# EasyEDA Pro project tianmengxing-expansion-board.epro, schematic Schematic1

## Sheets
1 P1: Assembly Variant: Basic; Board Name: Board1; Create Date: 2026-07-14; Page Name: P1; Project Name: 天猛星; Schematic Name: Schematic1; Update Date: 2026-07-14; Company: 嘉立创EDA; Page Size: A4; Version: V1.0
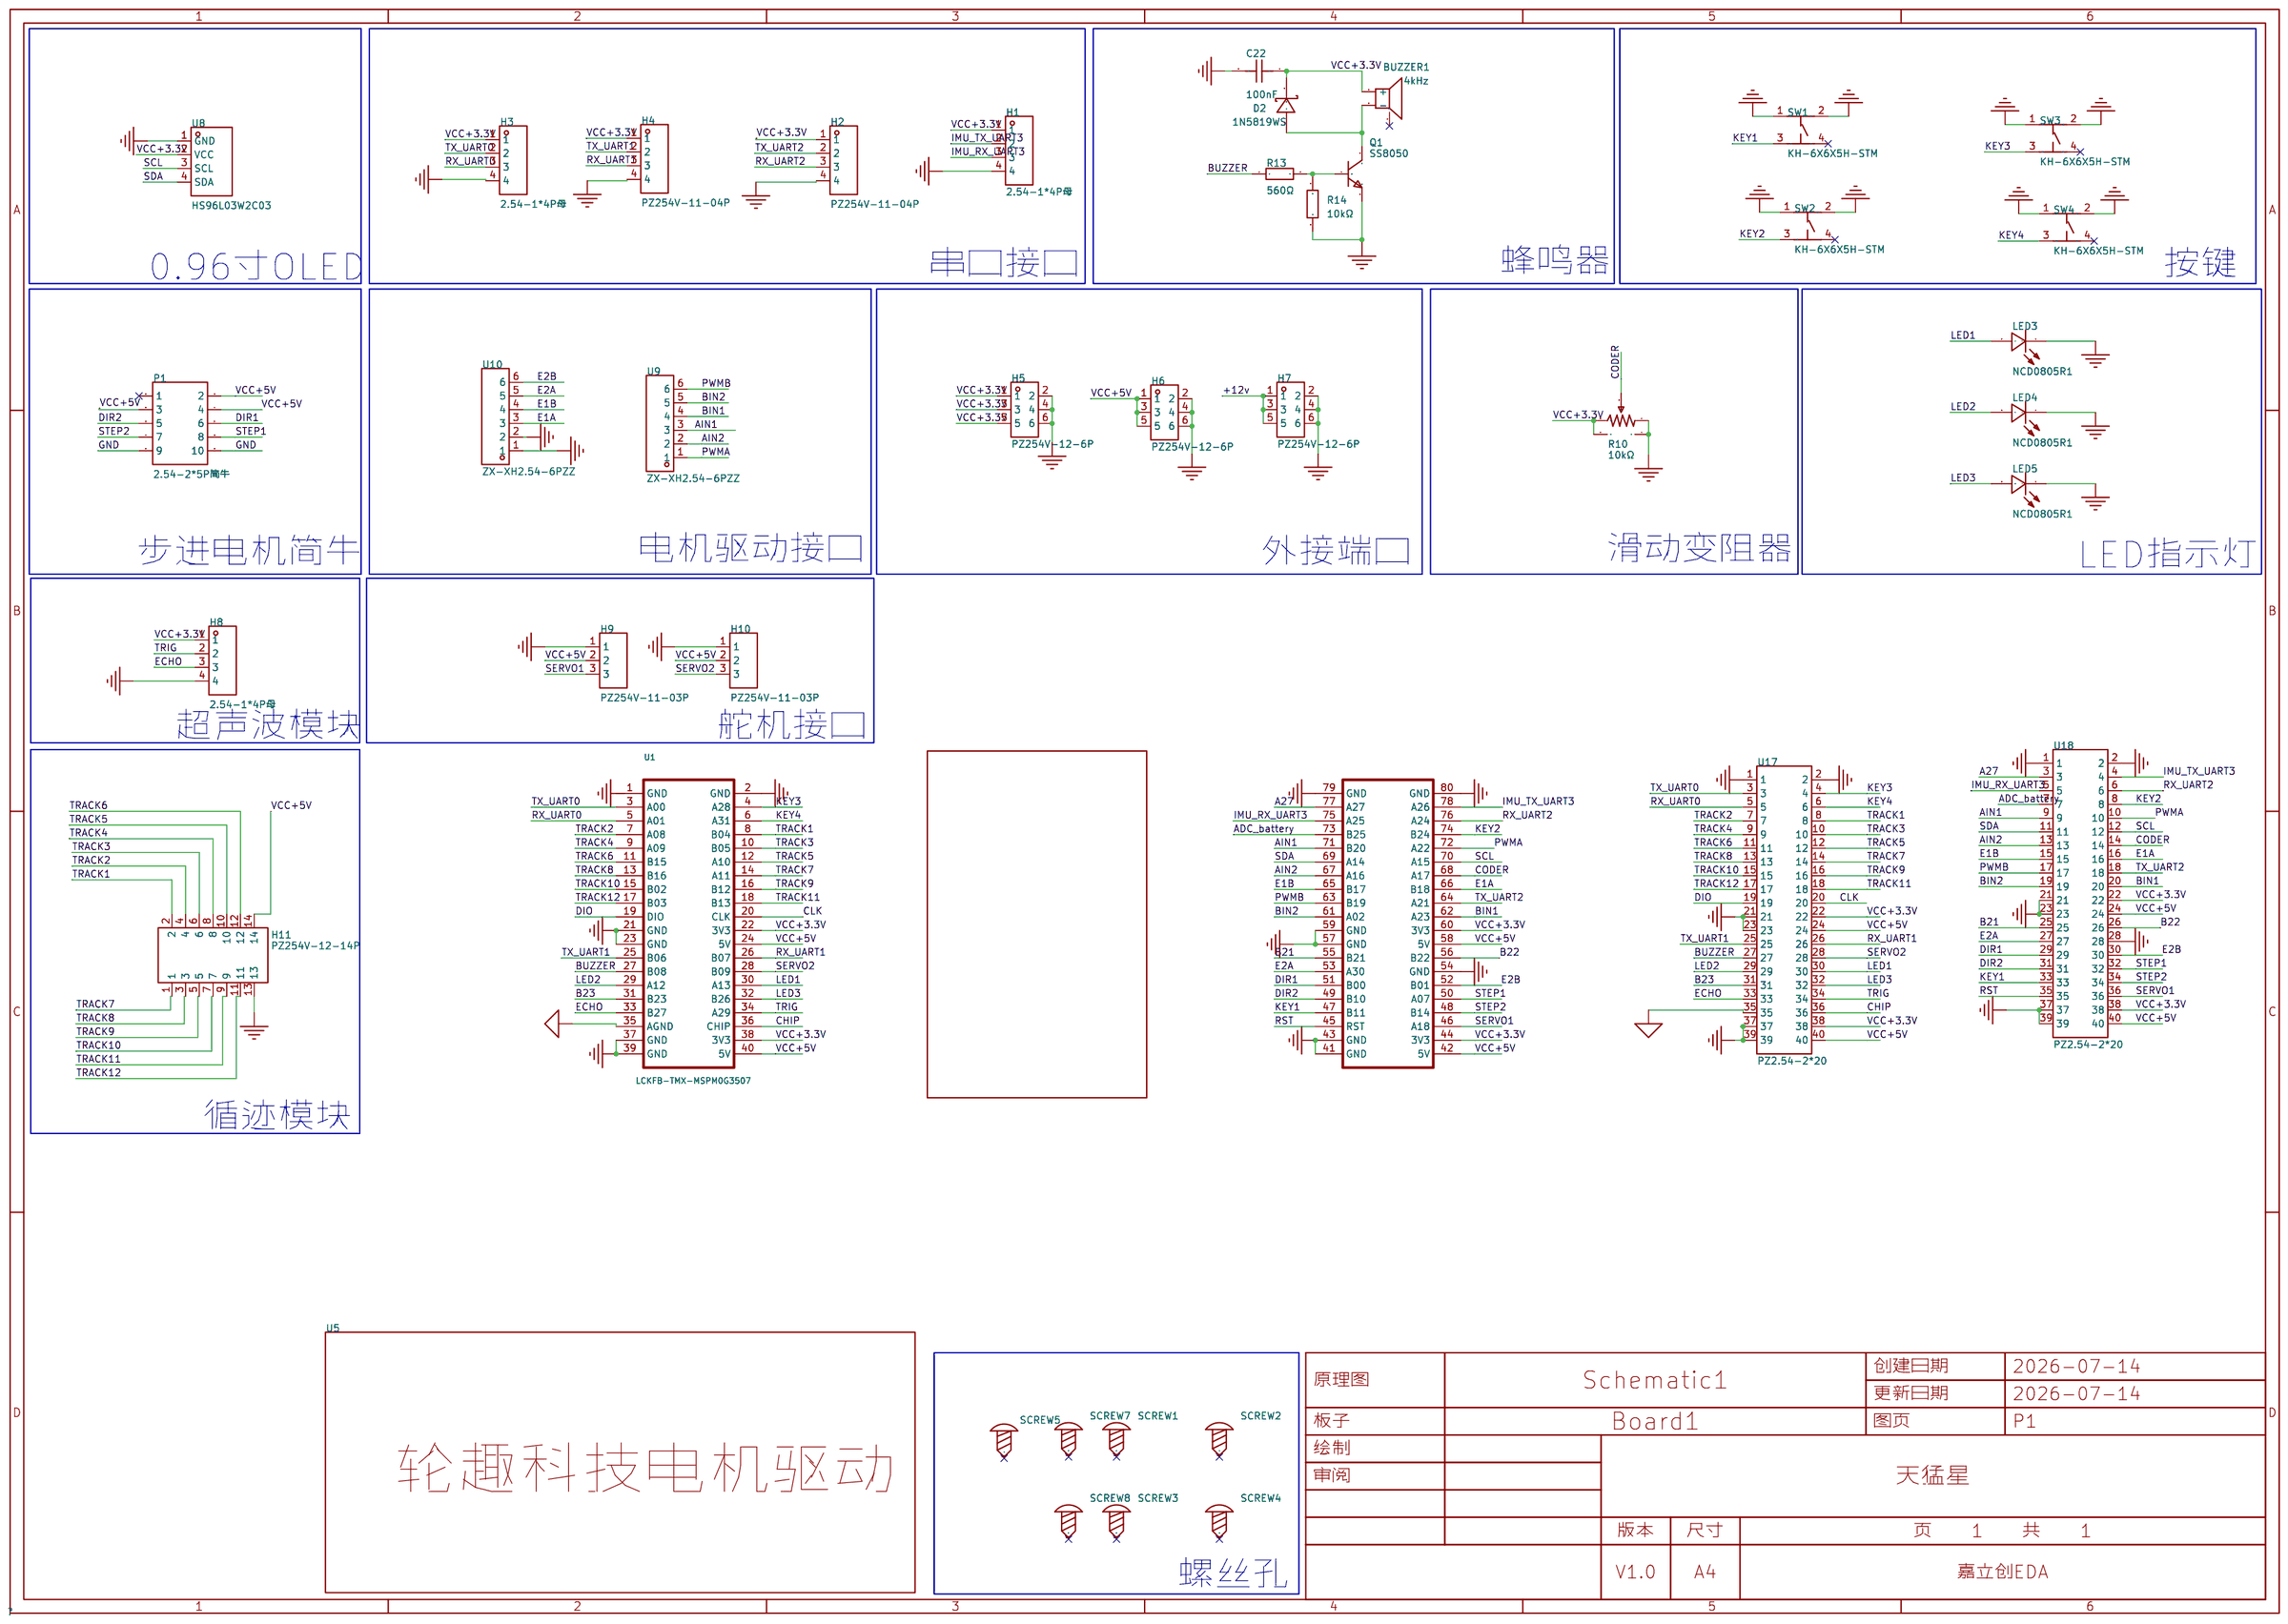
[diagram p0: P1]
2 电源: Create Date: 2025-01-22; Page Name: 电源; Project Name: stm32电赛单片机开发板; Update Date: 2025-02-09
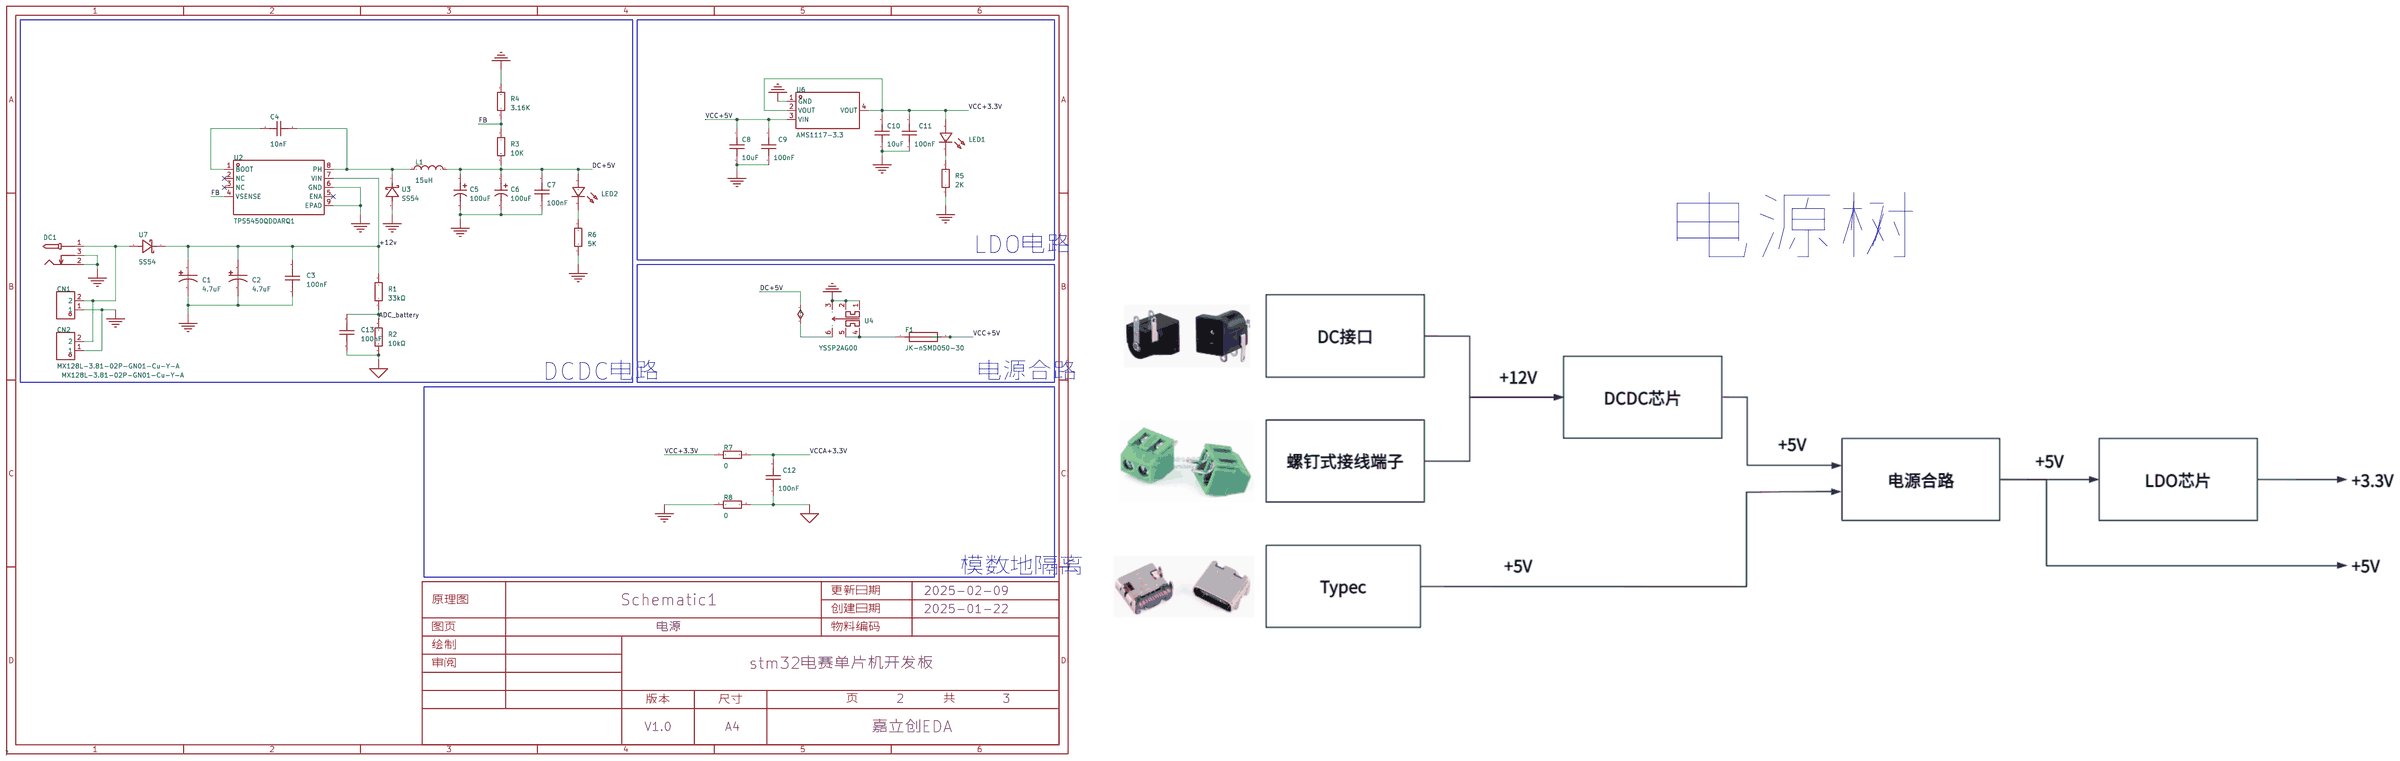
[diagram p1: 电源]

## Parts
sheet P1
BUZZER1  4kHz  [BUZ-SMD_L5.0-W5.5-P4.60]
C22  100nF  [C0603]
D2  1N5819WS  [SOD-323_L1.8-W1.3-LS2.5-RD]
H1  2.54-1*4P母  [HDR-TH_4P-P2.54-V-F]
H2  PZ254V-11-04P  [HDR-TH_4P-P2.54-V-M]
H3  2.54-1*4P母  [HDR-TH_4P-P2.54-V-F]
H4  PZ254V-11-04P  [HDR-TH_4P-P2.54-V-M]
H5  PZ254V-12-6P  [HDR-TH_6P-P2.54-V-M-R2-C3-S2.54]
H6  PZ254V-12-6P  [HDR-TH_6P-P2.54-V-M-R2-C3-S2.54]
H7  PZ254V-12-6P  [HDR-TH_6P-P2.54-V-M-R2-C3-S2.54]
H8  2.54-1*4P母  [HDR-TH_4P-P2.54-V-F]
H9  PZ254V-11-03P  [HDR-TH_3P-P2.54-V-M_PZ254V-11-03P]
H10  PZ254V-11-03P  [HDR-TH_3P-P2.54-V-M_PZ254V-11-03P]
H11  PZ254V-12-14P  [HDR-TH_14P-P2.54-V-M-R2-C7-S2.54]
LED3  NCD0805R1  [LED0805-RD]
LED4  NCD0805R1  [LED0805-RD]
LED5  NCD0805R1  [LED0805-RD]
P1  2.54-2*5P简牛  [IDC-TH_10P-P2.54_C5665]
Q1  SS8050  [SOT-23_L2.9-W1.3-P1.90-LS2.4-BR]
R10  10kΩ  [RES-ADJ-TH_RK09L1140A5L]
R13  560Ω  [R0603]
R14  10kΩ  [R0603]
SCREW1  -  [M3螺丝]
SCREW2  -  [M3螺丝]
SCREW3  -  [M3螺丝]
SCREW4  -  [M3螺丝]
SCREW5  -  [M2螺丝]
SCREW7  -  [M3螺丝]
SCREW8  -  [M3螺丝]
SW1  KH-6X6X5H-STM  [SW-SMD_4P-L6.0-W6.0-P4.50-LS9.0_H5.0]
SW2  KH-6X6X5H-STM  [SW-SMD_4P-L6.0-W6.0-P4.50-LS9.0_H5.0]
SW3  KH-6X6X5H-STM  [SW-SMD_4P-L6.0-W6.0-P4.50-LS9.0_H5.0]
SW4  KH-6X6X5H-STM  [SW-SMD_4P-L6.0-W6.0-P4.50-LS9.0_H5.0]
U1  LCKFB-TMX-MSPM0G3507  [COMM-TH_LCKFB-TMX-MSPM0G3507]
U5  -  [轮趣科技电机驱动]
U8  HS96L03W2C03  [OLED-TH_L27.8-W27.2-P2.54_C9900033791]
U9  ZX-XH2.54-6PZZ  [CONN-TH_6P-P2.50_ZX-XH2.54-6PZZ]
U10  ZX-XH2.54-6PZZ  [CONN-TH_6P-P2.50_ZX-XH2.54-6PZZ]
U17  PZ2.54-2*20  [HDR-TH_40P-P2.54-V-M-R2-C20-S2.54]
U18  PZ2.54-2*20  [HDR-TH_40P-P2.54-V-M-R2-C20-S2.54]
sheet 电源
C1  4.7uF  [CAP-SMD_BD5.0-L5.3-W5.3-FD]
C2  4.7uF  [CAP-SMD_BD5.0-L5.3-W5.3-FD]
C3  100nF  [C0603]
C4  10nF  [C0603]
C5  100uF  [CAP-SMD_BD6.3-L6.6-W6.6-LS7.6-FD-1]
C6  100uF  [CAP-SMD_BD6.3-L6.6-W6.6-LS7.6-FD-1]
C7  100nF  [C0603]
C8  10uF  [C0603]
C9  100nF  [C0603]
C10  10uF  [C0603]
C11  100nF  [C0603]
C12  100nF  [C0603]
C13  100nF  [C0603]
CN1  MX128L-3.81-02P-GN01-Cu-Y-A  [CONN-TH_2P-P3.81_MX128L-3.81-GN01-02P-CU-Y-A]
CN2  MX128L-3.81-02P-GN01-Cu-Y-A  [CONN-TH_2P-P3.81_MX128L-3.81-GN01-02P-CU-Y-A]
DC1  -  [DC-005_2.5]
F1  JK-nSMD050-30  [F1206]
L1  15uH  [IND-SMD_L7.3-W6.6]
LED1  -  [LED_0603]
LED2  -  [LED_0603]
R1  33kΩ  [R0603]
R2  10kΩ  [R0402]
R3  10K  [R0603]
R4  3.16K  [R0603]
R5  2K  [R0603]
R6  5K  [R0603]
R7  0  [R0603]
R8  0  [R0603]
U2  TPS5450QDDARQ1  [SOIC-8_L4.9-W3.9-P1.27-LS6.0-BL-EP]
U3  SS54  [SMA_L4.2-W2.6-LS5.1-RD]
U4  YSSP2AG00  [SW-SMD_YSSP2AG00]
U6  AMS1117-3.3  [SOT-223-3_L6.5-W3.4-P2.30-LS7.0-BR]
U7  SS54  [SMA_L4.2-W2.6-LS5.1-RD]

## Library data of the parts
BUZZER1 = MLT-5020: 驱动方式:无源(外部驱动);构造类型:电磁式;额定电压:3V;频率:4kHz;声压(SPL):75dB;; LCSC Part Name: 无源(外部驱动) 电磁式 4kHz; Supplier Part: C94598; Manufacturer: 华能; Supplier Footprint: SMD,5x5mm; JLCPCB Part Class: Extended Part; Datasheet: https://item.szlcsc.com/datasheet/MLT-5020/95796.html; Supplier: LCSC; Driver Circuitry: 无源(外部驱动); Technology: 电磁式; Voltage Rating: 3V; Voltage - Supply: 2V~4V; Current Consumption: 100mA; Sound Pressure Level(SPL): 75dB; Length: 5.2mm; Width: 5.2mm; Height: 2.5mm; Operating Temperature: -20℃~+70℃
C22 = CL10B104KB8NNNC: 容值:100nF;精度:±10%;额定电压:50V;温度系数:X7R;; LCSC Part Name: 100nF ±10% 50V; Supplier Part: C1591; Manufacturer: SAMSUNG(三星); Supplier Footprint: 0603; JLCPCB Part Class: Extended Part; Datasheet: https://item.szlcsc.com/datasheet/CL10B104KB8NNNC/1943.html; Supplier: LCSC; Tolerance: ±10%; Voltage Rating: 50V; Temperature Coefficient: X7R
D2 = 1N5819WS_C191023: 正向压降(Vf):600mV@1A;直流反向耐压(Vr):40V;整流电流:1A;; LCSC Part Name: 电压:40V 电流:1A; Supplier Part: C191023; Manufacturer: Hottech(合科泰); Supplier Footprint: SOD-323; JLCPCB Part Class: Basic Part; Datasheet: https://item.szlcsc.com/datasheet/1N5819WS/213850.html; Supplier: LCSC; Voltage - Forward(Vf@If): 600mV@1A; Voltage - DC Reverse(Vr): 40V; Current - Rectified: 1A; Non-Repetitive Peak Forward Surge Current: 25A
H1 H3 H8 = 2.54-1*4P母: 插孔结构:1x4P;间距:2.54mm;行距:-;圆孔/方孔:方孔;安装方式:直插;排数:单排;总孔位数:4P;额定电流:3A;额定电压:-;插孔方向:顶部;塑高:-;触头材质:青铜;触头镀层:-;工作温度:-40℃~+105℃;; LCSC Part Name: 间距:2.54mm 1x4P 直插; Supplier Part: C2718488; Manufacturer: BOOMELE(博穆精密); Supplier Footprint: 插件,P=2.54mm; JLCPCB Part Class: Extended Part; Datasheet: https://item.szlcsc.com/datasheet/2.54-1*4P%25E6%25AF%258D/2834502.html; Supplier: LCSC; Holes Structure: 1x4P; Pitch: 2.54mm; Circular Hole / Square Hole: 方孔; Mounting Type: 直插; Number of Rows: 单排; Number of Positions: 4P; Current Rating: 3A; Holes Direction: 顶部; Contact Material: 青铜; Operating Temperature: -40℃~+105℃
H2 H4 = PZ254V-11-04P: 插针结构:1x4P;间距:2.54mm;行距:-;圆针/方针:方针;安装方式:直插;排数:单排;总PIN位数:4P;额定电流:3A;额定电压:250V;配合针长度:6mm;塑高:2.5mm;端接针长度:3mm;触头材质:-;工作温度:-40℃~+105℃;颜色:黑色;; LCSC Part Name: 1x4P 间距:2.54mm 方针 直插; Supplier Part: C2691448; Manufacturer: XFCN(兴飞); Supplier Footprint: 插件,P=2.54mm; JLCPCB Part Class: Extended Part; Datasheet: https://item.szlcsc.com/datasheet/PZ254V-11-04P/2801085.html; Supplier: LCSC; Pin Structure: 1x4P; Pitch: 2.54mm; Circluar Pins/Square Pins: 方针; Mounting Type: 直插; Number of Rows: 单排; Number of Pins: 4P; Current Rating: 3A; Voltage Rating (Max): 250V; Length of Mating Pin: 6mm; Insulation Height: 2.5mm; Length of End Connection Pin: 3mm; Operating Temperature: -40℃~+105℃; Color: 黑色
H5-H7 = PZ254V-12-6P: 插针结构:2x3P;间距:2.54mm;行距:2.54mm;圆针/方针:方针;安装类型:直插;排数:双排;总PIN位数:6P;额定电流:-;额定电压:-;配合针长度:6mm;塑高:2.5mm;端接针长度:3mm;触头材质:黄铜;触头镀层:-;工作温度范围:-40℃~+105℃;颜色:黑色;; LCSC Part Name: 间距:2.54mm 2x3P 直插 方针; Supplier Part: C492420; Manufacturer: XFCN(兴飞); Supplier Footprint: 插件,P=2.54mm; JLCPCB Part Class: Extended Part; Datasheet: https://atta.szlcsc.com/upload/public/pdf/source/20200309/C492420_BAECB307B001054C09D200388220EAE6.pdf; Supplier: LCSC; Pin Structure: 2x3P; Pitch: 2.54mm; Row Spacing: 2.54mm; Circluar Pins/Square Pins: 方针; Mounting Type: 直插; Number of Rows: 双排; Number of Pins: 6P; Length of Mating Pin: 6mm; Insulation Height: 2.5mm; Length of End Connection Pin: 3mm; Contact Material: 黄铜; Operating Temperature Range: -40℃~+105℃; Color: 黑色
H9 H10 = PZ254V-11-03P: 插针结构:1x3P;间距:2.54mm;行距:-;圆针/方针:方针;安装方式:直插;排数:单排;总PIN位数:3P;额定电流:3A;额定电压:250V;配合针长度:6mm;塑高:2.5mm;端接针长度:3mm;工作温度:-40℃~+105℃;颜色:黑色;; LCSC Part Name: 1x3P 间距:2.54mm 方针 直插; Supplier Part: C2937625; Manufacturer: XFCN(兴飞); Supplier Footprint: 插件,P=2.54mm; JLCPCB Part Class: Extended Part; Datasheet: https://item.szlcsc.com/datasheet/PZ254V-11-03P/3293280.html; Supplier: LCSC; Pin Structure: 1x3P; Pitch: 2.54mm; Circluar Pins/Square Pins: 方针; Mounting Type: 直插; Number of Rows: 单排; Number of Pins: 3P; Current Rating: 3A; Voltage Rating (Max): 250V; Length of Mating Pin: 6mm; Insulation Height: 2.5mm; Length of End Connection Pin: 3mm; Operating Temperature: -40℃~+105℃; Color: 黑色
H11 = PZ254V-12-14P: 插针结构:2x7P;间距:2.54mm;行距:2.54mm;圆针/方针:方针;安装方式:直插;排数:双排;总PIN位数:14P;额定电流:-;额定电压:-;配合针长度:6mm;塑高:2.5mm;端接针长度:3mm;触头材质:黄铜;触头镀层:-;工作温度:-40℃~+105℃;颜色:黑色;; LCSC Part Name: 2x7P 间距:2.54mm 方针 直插; Supplier Part: C492424; Manufacturer: XFCN(兴飞); Supplier Footprint: 插件,P=2.54mm; JLCPCB Part Class: Extended Part; Datasheet: https://item.szlcsc.com/datasheet/PZ254V-12-14P/502980.html; Supplier: LCSC; Pin Structure: 2x7P; Pitch: 2.54mm; Row Spacing: 2.54mm; Circluar Pins/Square Pins: 方针; Mounting Type: 直插; Number of Rows: 双排; Number of Pins: 14P; Length of Mating Pin: 6mm; Insulation Height: 2.5mm; Length of End Connection Pin: 3mm; Contact Material: 黄铜; Operating Temperature: -40℃~+105℃; Color: 黑色
LED3-LED5 = NCD0805R1: 灯头类型:-;发光颜色:红色;正向压降(Vf):1.6V~2.6V;功率:65mW;正向电流:25mA;波长:615nm~630nm;二极管配置:独立二极管;透镜颜色:-;色温:-;发光强度:195mcd;发光角度:130°;载带方式:-;工作温度:-30℃~+85℃;; LCSC Part Name: 片式发光二极管; Supplier Part: C84256; Manufacturer: 国星光电; Supplier Footprint: 0805; JLCPCB Part Class: Basic Part; Datasheet: https://item.szlcsc.com/datasheet/NCD0805R1/85425.html; Supplier: LCSC; Illumination Color: 红色; Voltage - Forward(Vf): 1.6V~2.6V; Power(Watts): 65mW; Forward Current: 25mA; Wavelength - Dominant: 615nm~630nm; Peak Wavelength: 630nm; Diode Configuration: 独立二极管; Luminous Intensity: 195mcd; Viewing Angle: 130°; Operating Temperature: -30℃~+85℃
P1 = 2.54-2*5P简牛: 连接器类型:简牛座;间距:2.54mm;结构:2x5P;额定电流:1A;安装方式:直插;行距:2.54mm;排数:2;每排PIN数:5;触头材质:黄铜;触头镀层:金;工作温度:-55℃~+105℃;; LCSC Part Name: 2.54mm 2x5P 排数:2 每排P数:5; Supplier Part: C5665; Manufacturer: BOOMELE(博穆精密); Supplier Footprint: 插件,P=2.54mm; JLCPCB Part Class: Extended Part; Supplier: LCSC; Connector Type: 简牛座; Pitch: 2.54mm; Number of Positions or Pins: 2x5P; Current Rating: 1A; Holder Type: 直插; Row Spacing: 2.54mm; Number of Rows: 2; Number of PINs Per Row: 5; Contact Material: 黄铜; Contact Plating: 金; Operating Temperature: -55℃~+105℃; Color: 黑色
Q1 = SS8050_C431710: 晶体管类型:NPN;集电极电流(Ic):1.5A;集射极击穿电压(Vceo):25V;耗散功率(Pd):300mW;直流电流增益(hFE):400@100mA,1V;; LCSC Part Name: (200-350) NPN 电流:1.5A 电压:25V; Supplier Part: C431710; Manufacturer: MDD(辰达半导体); Supplier Footprint: SOT-23; JLCPCB Part Class: Extended Part; Datasheet: https://item.szlcsc.com/datasheet/SS8050/428175.html; Supplier: LCSC; type: NPN; Current - Collector(Ic): 1.5A; Collector - Emitter Voltage VCEO: 25V; Pd - Power Dissipation: 300mW; DC Current Gain: 400@100mA,1V; Transition frequency(fT): 100MHz; Current - Collector Cutoff: 100nA; Vce Saturation(VCE(sat)): 500mV@800mA,80mA; Operating Temperature: -55℃~+150℃; Emitter-Base Voltage(Vebo): 5V; Number: 1个NPN
R10 = RK09L1140A5L: 阻值:10kΩ;精度:±20%;功率:50mW;; LCSC Part Name: 3件套 旋转电位器（金属轴）; Supplier Part: C7419101; Manufacturer: ALPSALPINE(阿尔卑斯阿尔派); Supplier Footprint: 插件; JLCPCB Part Class: Extended Part; Datasheet: https://item.szlcsc.com/datasheet/RK09L1140A5L/8392216.html; Supplier: LCSC; Tolerance: ±20%; Voltage Rating: 10V; Power(Watts): 50mW
R13 = 0603WAF5600T5E: 电阻类型:厚膜电阻;阻值:560Ω;精度:±1%;功率:100mW;工作电压:75V;温度系数:±100ppm/℃;; LCSC Part Name: 560Ω ±1% 100mW 厚膜电阻; Supplier Part: C23204; Manufacturer: UNI-ROYAL(厚声); Supplier Footprint: 0603; JLCPCB Part Class: Basic Part; Datasheet: https://item.szlcsc.com/datasheet/0603WAF5600T5E/23931.html; Supplier: LCSC; Type: 厚膜电阻; Tolerance: ±1%; Power(Watts): 100mW; Voltage-Supply(Max): 75V; Temperature Coefficient: ±100ppm/℃; Operating Temperature: -55℃~+155℃
R14 = 0603WAF1002T5E: 电阻类型:厚膜电阻;阻值:10kΩ;精度:±1%;功率:100mW;工作电压:75V;温度系数:±100ppm/℃;; LCSC Part Name: 厚膜电阻 10kΩ ±1% 100mW; Supplier Part: C25804; Manufacturer: UNI-ROYAL(厚声); Supplier Footprint: 0603; JLCPCB Part Class: Basic Part; Datasheet: https://item.szlcsc.com/datasheet/0603WAF1002T5E/26547.html; Supplier: LCSC; Type: 厚膜电阻; Tolerance: ±1%; Power(Watts): 100mW; Voltage-Supply(Max): 75V; Temperature Coefficient: ±100ppm/℃; Operating Temperature: -55℃~+155℃
SCREW1-SCREW4 SCREW7 SCREW8 = M3螺丝: Supplier Footprint: 插件
SCREW5 = M2螺丝: Supplier Footprint: 插件
SW1-SW4 = KH-6X6X5H-STM: 电路结构:单刀单掷;按钮形状:圆形按钮;安装方式:立贴;开关长度:6mm;开关宽度:6mm;开关高度:5mm;带支架:不带支架;触点电流:50mA;额定电压:12V;工作寿命:8万次;; LCSC Part Name: 6*6*5mm 立贴 轻触开关; Supplier Part: C2837531; Manufacturer: kinghelm(金航标); Supplier Footprint: SMD-4P,6x6mm; JLCPCB Part Class: Extended Part; Datasheet: https://item.szlcsc.com/datasheet/KH-6X6X5H-STM/3009601.html; Supplier: LCSC; Circuit: 单刀单掷; Actuator Style: 圆形按钮; Mounting Type: 立贴; Length: 6mm; Width: 6mm; Switch Height: 5mm; with Bracket: 不带支架; Contact Current: 50mA; Voltage Rating: 12V; Actuator/Cap Color: 黑色; Termination Style: 鸥翼型; Life: 8万次
U1 = LCKFB-TMX-MSPM0G3507: 该开发板板载德州仪器的微控制器核心,完美适配电赛指定TI芯片题目的要求。支持Keil、CCS和IAU等环境开发,搭配图形化代码生成工具,无需在意底层驱动,助力快速开发。硬件上带有多电源保护,防反接/防过流/受电压,和三路参考电压选择,降低电衰试错成本。80P引脚的引出方便扩展,提供完善的入门手册和模块移植案例。; LCSC Part Name: 5件套 立创·天猛星MSPM0G3507开发板; Supplier Part: C42378531; Manufacturer: 立创开发板; JLCPCB Part Class: Extended Part; Datasheet: https://item.szlcsc.com/datasheet/LCKFB-TMX-MSPM0G3507/44281600.html; Supplier: LCSC
U5 = 轮趣科技电机驱动
U8 = HS96L03W2C03: 核心芯片:SSD1315芯片;接口类型:I2C;尺寸(inch):0.96;像素分辨率:128x64;; LCSC Part Name: 0.96寸OLED显示屏窄白光IIC; Supplier Part: C5248080; Manufacturer: HS(汉昇); JLCPCB Part Class: Extended Part; Datasheet: https://item.szlcsc.com/datasheet/HS96L03W2C03/5960631.html; Supplier: LCSC; Controller Type: SSD1315芯片; Interface: I2C; Size: 0.96; Dot Pixels: 128x64; Operating Temperature: -40℃~+70℃; Type of Drive: 无源(PMOLED); Display Range: 21.744x10.864mm; Display Color: 白色; Luminance: 180cd/m2
U9 U10 = ZX-XH2.54-6PZZ: 插针结构:1x6P;间距:2.5mm;安装方式:直插;参考系列:XH;总PIN数:6P;排数:1;每排PIN数:6;行距:-;额定电流:3A;触头材质:黄铜;触头镀层:锡;工作温度:-25℃~+85℃;; LCSC Part Name: 1x6P 间距:2.5mm 直插 系列:XH; Supplier Part: C7429636; Manufacturer: Megastar(兆星); Supplier Footprint: 插件,P=2.5mm; JLCPCB Part Class: Extended Part; Datasheet: https://item.szlcsc.com/datasheet/ZX-XH2.54-6PZZ/8427553.html; Supplier: LCSC; Pins Structure: 1x6P; Pitch: 2.5mm; Mounting Type: 直插; Reference Series: XH; Number of Pins: 6P; Number of Rows: 1; Number of PINs Per Row: 6; Current Rating: 3A; Contact Material: 黄铜; Contact Plating: 锡; Operating Temperature: -25℃~+85℃; Voltage Rating: 250V; Plastic Material: PA66; Flame Retardant Rating: UL94V-0; Color: 白色; Z-Height of the Board: 7mm; X-Length of Bottom Edge on Board (Spacing Line): 17.5mm; Y-Width of Bottom Edge on Board: 5.9mm
U17 U18 = PZ2.54-2*20: 插针结构:2x20P;间距:2.54mm;行距:2.54mm;圆针/方针:方针;安装方式:直插;排数:双排;总PIN位数:40P;额定电流:2.5A;配合针长度:6mm;塑高:2.54mm;端接针长度:3mm;触头材质:黄铜;触头镀层:金;工作温度:-40℃~+105℃;; LCSC Part Name: 2x20P 间距:2.54mm 方针 直插; Supplier Part: C5224014; Manufacturer: ZHOURI(洲日); Supplier Footprint: 插件,P=2.54mm; JLCPCB Part Class: Extended Part; Datasheet: https://item.szlcsc.com/datasheet/PZ2.54-2*20/5925193.html; Supplier: LCSC; Pin Structure: 2x20P; Pitch: 2.54mm; Row Spacing: 2.54mm; Circluar Pins/Square Pins: 方针; Mounting Type: 直插; Number of Rows: 双排; Number of Pins: 40P; Current Rating: 2.5A; Length of Mating Pin: 6mm; Insulation Height: 2.54mm; Length of End Connection Pin: 3mm; Contact Material: 黄铜; Contact Plating: 金; Operating Temperature: -40℃~+105℃
C1 C2 = EMVE500ADA4R7ME55G: 容值:4.7uF;精度:±20%;额定电压:50V;纹波电流:20mA@120Hz;等效串联电阻:-;; LCSC Part Name: 4.7uF ±20% 50V; Supplier Part: C178270; Manufacturer: NCC(日本贵弥功); Supplier Footprint: SMD,D5xL5.2mm; JLCPCB Part Class: 扩展库; Datasheet: https://atta.szlcsc.com/upload/public/pdf/source/20180530/C178280_3EF6968EAC9B0F0D2B2AB76FB03ACC1C.pdf; Supplier: LCSC; Tolerance: ±20%; Rated Voltage: 50V; Ripple Current: 20mA@120Hz; φD: 5mm; L: 5.2mm; Lifetime @ Temp: 1000hrs@105℃; Operating Temperature: -40℃~+105℃
C3 C4 C7-C12 = CAP_0603: Supplier Footprint: 0603
C5 C6 = RVE100UF35V67RV0072: 容值:100uF;精度:±20%;额定电压:35V;纹波电流:230mA@120Hz;等效串联电阻(ESR):600mΩ@100kHz;; LCSC Part Name: 100uF ±20% 35V; Supplier Part: C2836437; Manufacturer: KNSCHA(科尼盛); Supplier Footprint: SMD,D6.3xL7.7mm; JLCPCB Part Class: Extended Part; Datasheet: https://item.szlcsc.com/datasheet/RVE100UF35V67RV0072/3002609.html; Supplier: LCSC; Tolerance: ±20%; Voltage Rating: 35V; Ripple Current: 230mA@120Hz; Equivalent Series Resistance(ESR): 600mΩ@100kHz; Diameter: 6.3mm; Height - Seated (Max): 7.7mm; Lifetime: 2000hrs@105℃; Operating Temperature: -55℃~+105℃
C13 = CC0603KRX7R9BB104: 容值:100nF;精度:±10%;额定电压:50V;温度系数:X7R;; LCSC Part Name: 100nF ±10% 50V; Supplier Part: C14663; Manufacturer: YAGEO(国巨); Supplier Footprint: 0603; JLCPCB Part Class: Basic Part; Datasheet: https://item.szlcsc.com/datasheet/CC0603KRX7R9BB104/15331.html; Supplier: LCSC; Tolerance: ±10%; Voltage Rating: 50V; Temperature Coefficient: X7R
CN1 CN2 = MX128L-3.81-02P-GN01-Cu-Y-A: 结构:1x2P;间距:3.81mm;颜色:绿色;安装方式:直插;排数:1;每排PIN数:2;额定电流:10A;额定电压:150V;线规 - AWG:16~26;线规 - 平方毫米:1.5;工作温度范围:-40℃~+105℃;; LCSC Part Name: 1x2P 3.81mm 直插 排数:1 每排P数:2; Supplier Part: C5188452; Manufacturer: MAX(迈旭); Supplier Footprint: 插件,P=3.81mm; JLCPCB Part Class: 扩展库; Datasheet: https://atta.szlcsc.com/upload/public/pdf/source/20230914/B6D11694B2EF123065C24316748628EB.pdf; Supplier: LCSC; Structure: 1x2P; Pitch: 3.81mm; Color: 绿色; Mounting Style: 直插; Number of Pins: 2P; Number of Rows: 1; Number of PINs Per Row: 2; Screw Specification: M2; Current Rating (Max): 10A; Voltage Rating (Max): 150V; Wire Gauge - AWG: 16~26; Wire Gauge - mm2: 1.5; Operating Temperature Range: -40℃~+105℃
DC1 = DC-005_2.5: Supplier Footprint: 插件
F1 = JK-nSMD050-30: 耐压(Vmax):30V;最大电流(Imax):100A;保持电流(Ihold):500mA;跳闸电流(Itrip):1A;; LCSC Part Name: 30V 500mA 1206自恢复; Supplier Part: C720075; Manufacturer: JK(金科); Supplier Footprint: 1206; JLCPCB Part Class: Extended Part; Datasheet: https://item.szlcsc.com/datasheet/JK-nSMD050-30/764095.html; Supplier: LCSC; Voltage - Max: 30V; Current - Max: 100A; Hold Current: 500mA; Trip Current: 1A; Power Dissipation: 600mW; Resistance - Initial (Ri) (Min): 150mΩ; Resistance - Post Trip (R1) (Max): 300mΩ; Time to Trip(Max): 100ms; Operating Temperature: -40℃~+85℃; Length: 3.5mm; Width: 1.8mm; Height: 1.2mm
L1 = 10uH/5A7*7mm一体成型电感: Supplier Part: C9900022584; JLCPCB Part Class: 扩展库; Supplier: LCSC
LED1 LED2 = LED_0603-G: Supplier Footprint: 0603
R1 = 0603WAF3302T5E: 电阻类型:厚膜电阻;阻值:33kΩ;精度:±1%;功率:100mW;工作电压:75V;温度系数:±100ppm/℃;; LCSC Part Name: 33kΩ ±1% 100mW 厚膜电阻; Supplier Part: C4216; Manufacturer: UNI-ROYAL(厚声); Supplier Footprint: 0603; JLCPCB Part Class: Basic Part; Datasheet: https://item.szlcsc.com/datasheet/0603WAF3302T5E/4623.html; Supplier: LCSC; Type: 厚膜电阻; Tolerance: ±1%; Power(Watts): 100mW; Voltage-Supply(Max): 75V; Temperature Coefficient: ±100ppm/℃; Operating Temperature: -55℃~+155℃
R2 = 0402WGF1002TCE: 电阻类型:厚膜电阻;阻值:10kΩ;精度:±1%;功率:62.5mW;工作电压:50V;温度系数:±100ppm/℃;; LCSC Part Name: 10kΩ ±1% 62.5mW 厚膜电阻; Supplier Part: C25744; Manufacturer: UNI-ROYAL(厚声); Supplier Footprint: 0402; JLCPCB Part Class: Basic Part; Datasheet: https://item.szlcsc.com/datasheet/0402WGF1002TCE/26487.html; Supplier: LCSC; Type: 厚膜电阻; Tolerance: ±1%; Power(Watts): 62.5mW; Voltage-Supply(Max): 50V; Temperature Coefficient: ±100ppm/℃; Operating Temperature: -55℃~+155℃
R3-R8 = Res_0603: Supplier Footprint: 0603
U2 = TPS5450QDDARQ1: 功能类型:降压型;输出类型:可调;工作电压:5.5V~36V;输出电压:1.221V~32.04V;输出电流:5A;; LCSC Part Name: 5A宽输入范围降压转换器; Supplier Part: C181270; Manufacturer: TI(德州仪器); Supplier Footprint: SOIC-8-EP; JLCPCB Part Class: 扩展库; Datasheet: https://www.ti.com/cn/lit/gpn/tps5450-q1; Supplier: LCSC; Function: 降压型; Output Type: 可调; Input Voltage: 5.5V~36V; Output Voltage: 1.221V~32.04V; Output Current: 5A; Switching Frequency: 500kHz; Operating Temperature: -40℃~+125℃@(TJ); Synchronous Rectification: 否; Number of Outputs: 1; Topology: 降压式; Switch tube (built-in/external): 内置
U3 U7 = SS54: Supplier Part: C9900023219; Supplier Footprint: (1N5824)DO-214; JLCPCB Part Class: 扩展库; Supplier: LCSC
U4 = YSSP2AG00: LCSC Part Name: 9x3.6 正按6脚贴片滑动开关; Supplier Part: C5188558; Manufacturer: YIYUAN(怡远); Supplier Footprint: SMD; JLCPCB Part Class: 扩展库; Datasheet: https://atta.szlcsc.com/upload/public/pdf/source/20221011/AF6FF47B5A85181594B051FD518E9363.pdf; Supplier: LCSC
U6 = AMS1117-3.3_C6186: 输出类型:固定;最大输入电压:-;输出电压:3.3V;最大输出电流:1A;电源纹波抑制比(PSRR):72dB@(120Hz);输出极性:正极;; LCSC Part Name: 输出3.3V 1A; Supplier Part: C6186; Manufacturer: AMS; Supplier Footprint: SOT-223; JLCPCB Part Class: 基础库; Datasheet: https://atta.szlcsc.com/upload/public/pdf/source/20180727/C6186_7A095716F0823C02F1997A905E26C086.pdf; Supplier: LCSC; Output Type: 固定; Output Voltage: 3.3V; MAX Output Current: 1A; Power Supply Rejection Ratio (PSRR): 72dB@(120Hz); Dropout Voltage: 1.3V@(800mA); Output Polarity: 正极; Number of Outputs: 1

## Nets
+12v: C1.1 C2.1 C3.2 H7.1 H7.3 H7.5 R1.2 U2.7(VIN) U7.1(C)
AGND: C12.1 C13.1 R2.1 R8.2 U1.35(AGND) U17.35
GND: C1.2 C2.2 C3.1 C5.2 C6.2 C7.1 C8.1 C9.1 C10.1 C11.1 C22.2 CN1.1 CN2.1 DC1.2 DC1.3 H1.4 H2.4 H3.4 H4.4 H5.2 H5.4 H5.6 H6.2 H6.4 H6.6 H7.2 H7.4 H7.6 H8.4 H9.1 H10.1 H11.13 LED3.1(-) LED4.1(-) LED5.1(-) P1.9 P1.10 Q1.2(E) R4.2 R5.1 R6.1 R8.1 R10.1 R10.4 R14.2 SW1.1 SW1.2 SW2.1 SW2.2 SW3.1 SW3.2 SW4.1 SW4.2 U1.1(GND) U1.2(GND) U1.21(GND) U1.23(GND) U1.37(GND) U1.39(GND) U1.41(GND) U1.43(GND) U1.54(GND) U1.57(GND) U1.59(GND) U1.79(GND) U1.80(GND) U2.6(GND) U2.9(EPAD) U3.2(A) U4.1 U4.2 U4.3 U6.1(GND) U8.1(GND) U10.1 U10.2 U17.1 U17.2 U17.21 U17.23 U17.37 U17.39 U18.1 U18.2 U18.21 U18.23 U18.28 U18.37 U18.39
VCC+3.3V: BUZZER1.1(+) C10.2 C11.2 C22.1 D2.1(K) H1.1 H2.1 H3.1 H4.1 H5.1 H5.3 H5.5 H8.1 LED1.2(A) R7.1 R10.3 R10.5 U1.22(3V3) U1.38(3V3) U1.44(3V3) U1.60(3V3) U6.2(VOUT) U6.4(VOUT) U8.2(VCC) U17.22 U17.38 U18.22 U18.38
VCC+5V: C8.2 C9.2 F1.2 H6.1 H6.3 H6.5 H9.2 H10.2 H11.14 P1.2 P1.3 P1.4 U1.24(5V) U1.40(5V) U1.42(5V) U1.58(5V) U6.3(VIN) U17.24 U17.40 U18.24 U18.40
VCCA+3.3V: C12.2 R7.2
A27: U1.77(A27) U18.3
ADC_battery: C13.2 R1.1 R2.2 U1.73(B25) U18.7
AIN1: U1.71(B20) U9.3 U18.9
AIN2: U1.67(A16) U9.2 U18.13
B21: U1.55(B21) U18.25
B22: U1.56(B22) U18.26
B23: U1.31(B23) U17.31
BIN1: U1.62(A23) U9.4 U18.20
BIN2: U1.61(A02) U9.5 U18.19
BUZZER: R13.1 U1.27(B08) U17.27
CHIP: U1.36(CHIP) U17.36
CLK: U1.20(CLK) U17.20
CODER: R10.2 U1.68(A17) U18.14
DC+5V: C5.1 C6.1 C7.2 L1.2 LED2.2(A) R3.2 U4.6
DIO: U1.19(DIO) U17.19
DIR1: P1.6 U1.51(B00) U18.29
DIR2: P1.5 U1.49(B10) U18.31
E1A: U1.66(B18) U10.3 U18.16
E1B: U1.65(B17) U10.4 U18.15
E2A: U1.53(A30) U10.5 U18.27
E2B: U1.52(B01) U10.6 U18.30
ECHO: H8.3 U1.33(B27) U17.33
FB: R3.1 R4.1 U2.4(VSENSE)
IMU_RX_UART3: H1.3 U1.75(A25) U18.5
IMU_TX_UART3: H1.2 U1.78(A26) U18.4
KEY1: SW1.3 U1.47(B11) U18.33
KEY2: SW2.3 U1.74(B24) U18.8
KEY3: SW3.3 U1.4(A28) U17.4
KEY4: SW4.3 U1.6(A31) U17.6
LED1: LED3.2(+) U1.30(A13) U17.30
LED2: LED4.2(+) U1.29(A12) U17.29
LED3: LED5.2(+) U1.32(B26) U17.32
PWMA: U1.72(A22) U9.1 U18.10
PWMB: U1.63(B19) U9.6 U18.17
RST: U1.45(RST) U18.35
RX_UART0: H3.3 U1.5(A01) U17.5
RX_UART1: H4.3 U1.26(B07) U17.26
RX_UART2: H2.3 U1.76(A24) U18.6
SCL: U1.70(A15) U8.3(SCL) U18.12
SDA: U1.69(A14) U8.4(SDA) U18.11
SERVO1: H9.3 U1.46(A18) U18.36
SERVO2: H10.3 U1.28(B09) U17.28
STEP1: P1.8 U1.50(A07) U18.32
STEP2: P1.7 U1.48(B14) U18.34
TRACK1: H11.2 U1.8(B04) U17.8
TRACK2: H11.4 U1.7(A08) U17.7
TRACK3: H11.6 U1.10(B05) U17.10
TRACK4: H11.8 U1.9(A09) U17.9
TRACK5: H11.10 U1.12(A10) U17.12
TRACK6: H11.12 U1.11(B15) U17.11
TRACK7: H11.1 U1.14(A11) U17.14
TRACK8: H11.3 U1.13(B16) U17.13
TRACK9: H11.5 U1.16(B12) U17.16
TRACK10: H11.7 U1.15(B02) U17.15
TRACK11: H11.9 U1.18(B13) U17.18
TRACK12: H11.11 U1.17(B03) U17.17
TRIG: H8.2 U1.34(A29) U17.34
TX_UART0: H3.2 U1.3(A00) U17.3
TX_UART1: H4.2 U1.25(B06) U17.25
TX_UART2: H2.2 U1.64(A21) U18.18
$1N101: Q1.1(B) R13.2 R14.1
$1N102: BUZZER1.2(-) D2.2(A) Q1.3(C)
$4N821: CN1.2 CN2.2 DC1.1(4) U7.2(A)
$4N1523: C4.2 L1.1 U2.8(PH) U3.1(C)
$4N1532: C4.1 U2.1(BOOT)
$4N2883: LED1.1(C) R5.2
$4N2994: LED2.1(C) R6.2
$4N6141: F1.1 U4.4 U4.5

Not connected (* = marked no-connect by the designer): BUZZER1 3(NC)*; P1 1*; SCREW1 1*; SCREW2 1*; SCREW3 1*; SCREW4 1*; SCREW5 1*; SCREW7 1*; SCREW8 1*; SW1 4*; SW2 4*; SW3 4*; SW4 4*; U2 2(NC)* 3(NC)* 5(ENA)*

## Notes on the sheets
sheet 1
- 0.96寸OLED
- 串口接口
- 蜂鸣器
- 按键
- 电机驱动接口
- 滑动变阻器
- 步进电机简牛
- 外接端口
- LED指示灯
- 超声波模块
- 舵机接口
- 循迹模块
- 螺丝孔
sheet 2
- LDO电路
- 电源树
- DCDC电路
- 电源合路
- 模数地隔离
